# EAGLE design Placa_1 (EAGLE 8.3.2)
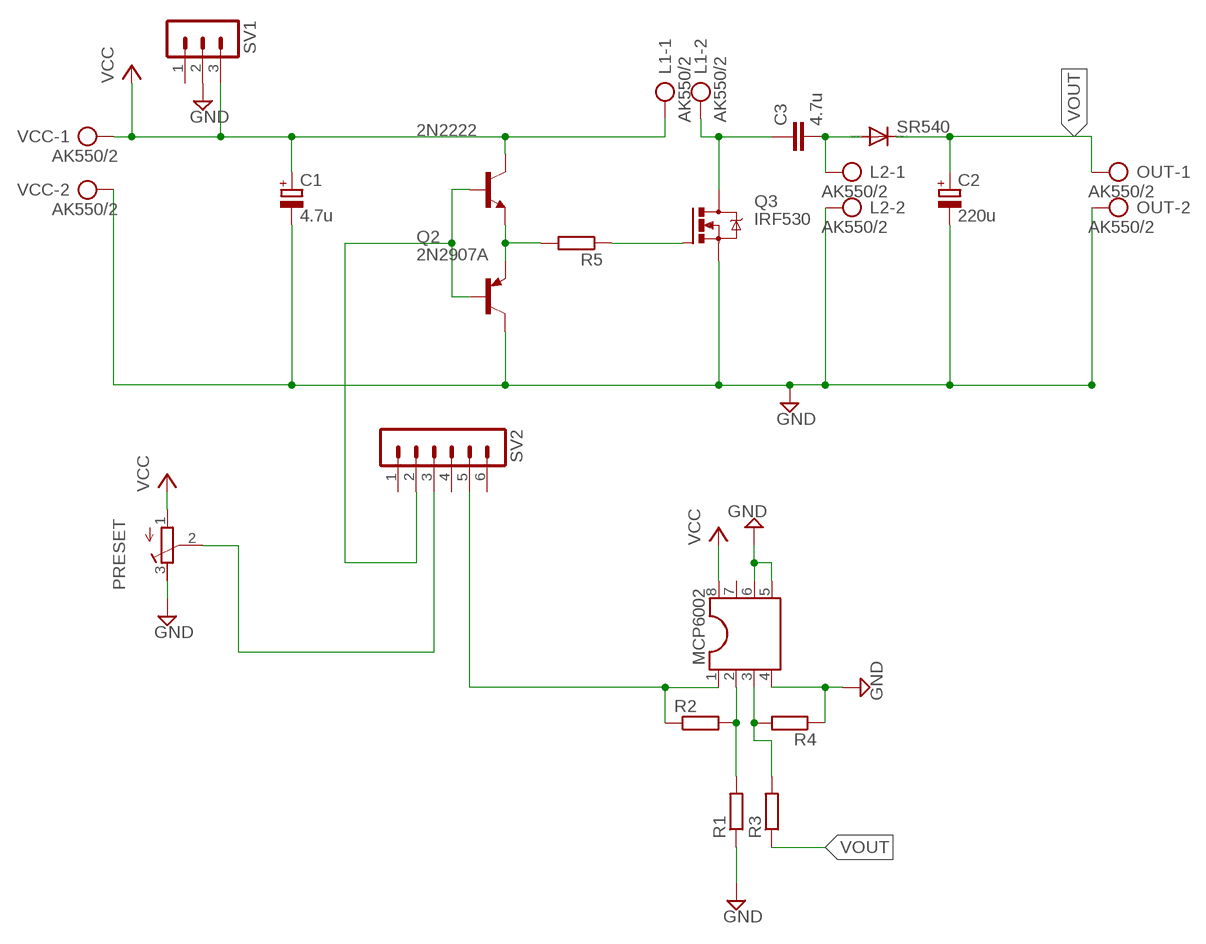
[diagram p0: schematic, sheet 1]

## Parts
2N2222  2N2222-NPN-TO92-EBC  [TO92-EBC]
C1  4.7u  CPOL-EUE5-8.5  [E5-8,5]
C2  220u  CPOL-EUE5-8.5  [E5-8,5]
C3  4.7u  C-EU075-052X106  [C075-052X106]
L1  AK550/2  [AK550/2]
L2  AK550/2  [AK550/2]
MCP6002  DIL8  [DIL08]
OUT  AK550/2  [AK550/2]
PRESET  R-TRIMM64W  [RTRIM64W]
Q2  2N2907A  [TO18]
Q3  IRF530  [TO220BV]
R1  R-EU_0207/10  [0207/10]
R2  R-EU_0207/10  [0207/10]
R3  R-EU_0207/10  [0207/10]
R4  R-EU_0207/10  [0207/10]
R5  R-EU_0207/10  [0207/10]
SR540  DIODE-DO27-15  [DO27-15]
SV1  MA03-1  [MA03-1]
SV2  MA06-1  [MA06-1]
VCC  AK550/2  [AK550/2]

## Nets
GND: C1.- C2.- L2.2 MCP6002.4 MCP6002.5 MCP6002.6 OUT.2 PRESET.3(E) Q2.3(C) Q3.S R1.1 R4.1 SV1.2 VCC.2
N$1: PRESET.2(S) SV2.3
N$2: C3.1 L1.2 Q3.D
N$3: C3.2 L2.1 SR540.A
N$4: 2N2222.E Q2.1(E) R5.2
N$5: MCP6002.3 R3.2 R4.2
N$6: 2N2222.B Q2.2(B) SV2.2
N$7: MCP6002.2 R1.2 R2.2
N$8: MCP6002.1 R2.1 SV2.5
N$9: Q3.G R5.1
VCC: 2N2222.C C1.+ L1.1 MCP6002.8 PRESET.1(A) SV1.3 VCC.1
VOUT: C2.+ OUT.1 R3.1 SR540.C
Unconnected: MCP6002.7 SV1.1 SV2.1 SV2.4 SV2.6

## Library data of the parts
2N2222 = transistor-neu-to92:*-NPN-: NPN Transistror
C1 C2 = resistor:CPOL-EU: POLARIZED CAPACITOR, European symbol
C3 = rcl:C-EU: CAPACITOR, European symbol
L1 L2 OUT VCC = con-ptr500:AK550/2: CONNECTOR; OC_FARNELL: unknown; OC_NEWARK: unknown
MCP6002 = ic-package:DIL8: Dual In Line / Socket
PRESET = resistor:R-TRIMM: Trimm resistor
Q2 = transistor-pnp:2N2907*: PNP Transistor
Q3 = transistor-power:IRF530: HEXFET Power MOSFET
R1-R5 = rcl:R-EU_: RESISTOR, European symbol
SR540 = diode:DIODE-: DIODE
SV1 = con-lstb:MA03-1: PIN HEADER; OC_FARNELL: unknown; OC_NEWARK: unknown
SV2 = con-lstb:MA06-1: PIN HEADER; OC_FARNELL: unknown; OC_NEWARK: unknown

## Board
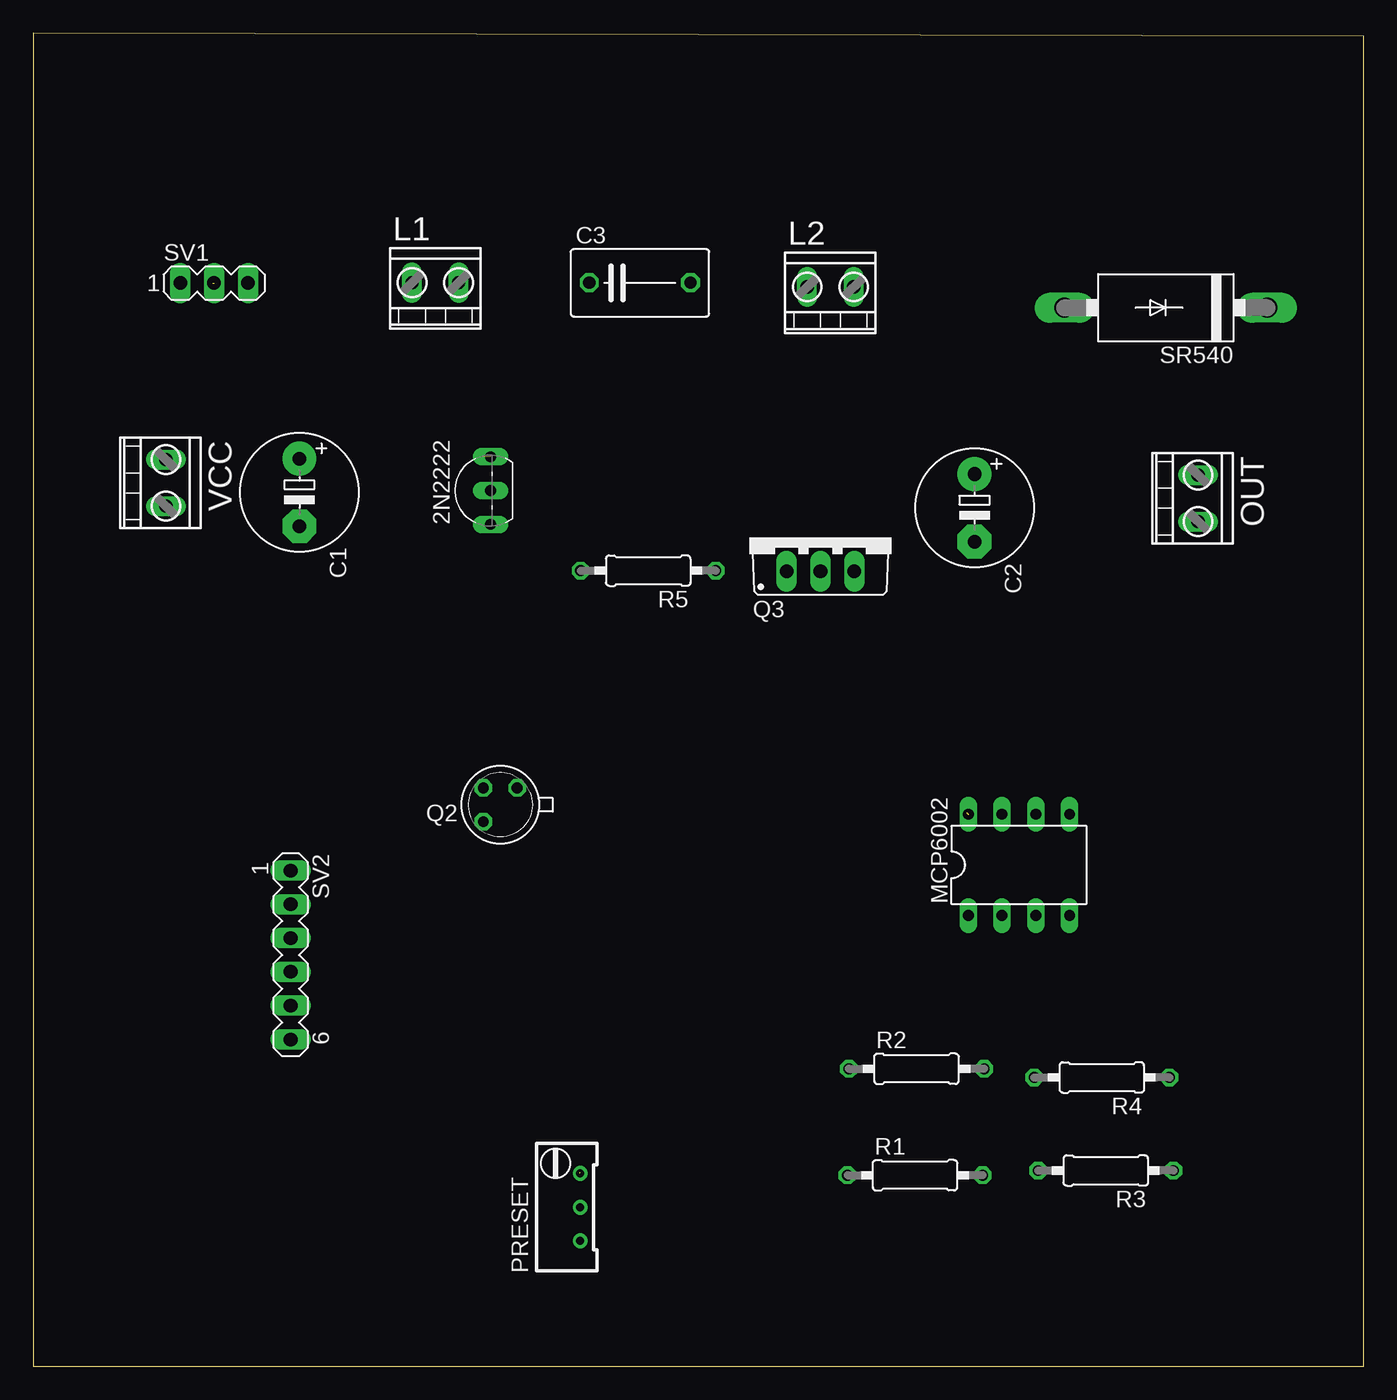
[diagram p1: board, top side]
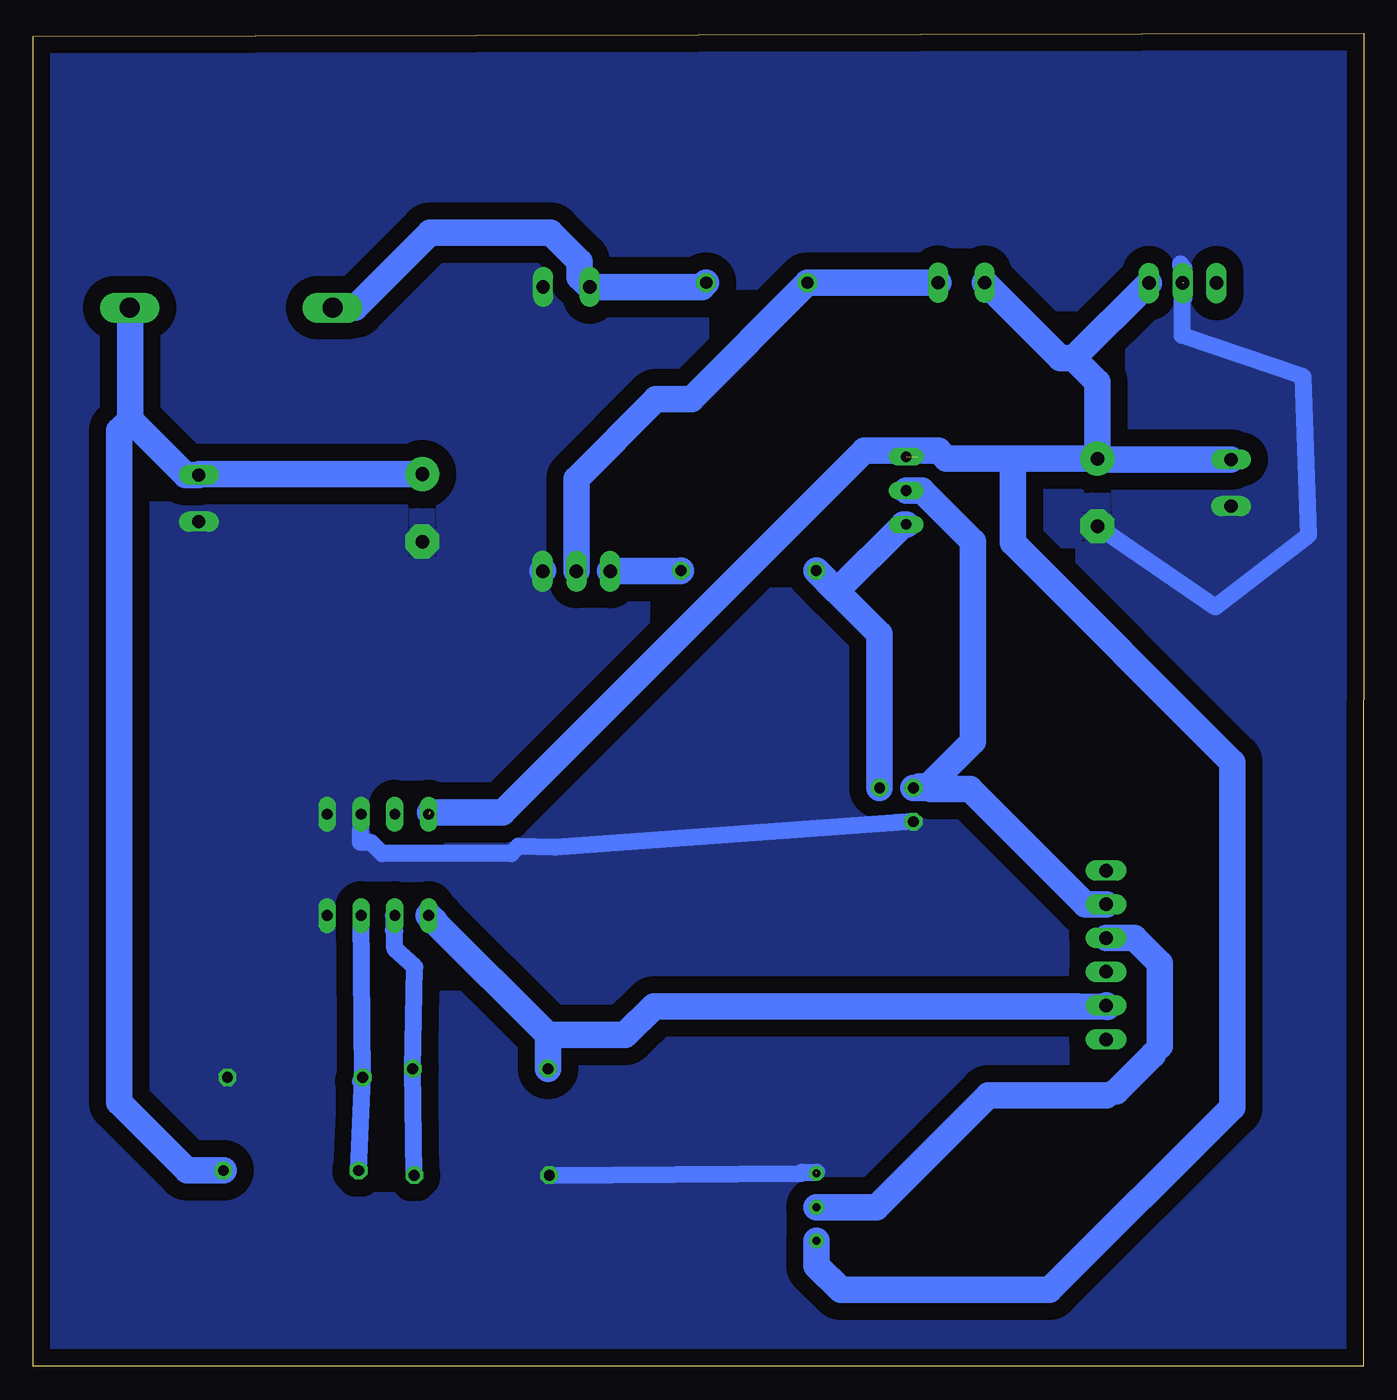
[diagram p2: board, bottom side, seen from below]

Size 100.01 x 100.21 mm. Coordinates in mm from the lower left corner, seen from the top.
Outline: 0.01,0 100.01,0 100.01,100 0,100.21 0.01,0
Copper layers (1*16): Top 0.035mm / dielectric 1.5mm / Bottom 0.035mm
Design rules "default *": minimum track width 1mm, minimum drill 0.35mm, track to track 1mm, track to pad 1mm, pad to pad 6mil, via to via 6mil, smd to smd 6mil, copper to edge 1mm, drill to drill 6mil, minimum pad ring 10mil, minimum via ring 8mil, stop-mask expansion 4mil, vias tented up to drill 0mil, thermal gap 10mil

### Footprints (pad centres in the part's own frame; a part is rotated, then mirrored left to right if it is on the bottom)
TO92-EBC = drill 0.813 long: B 0,-1.27; C 2.54,-1.27; E -2.54,-1.27
E5-8,5 = drill 1.016 pad 2.54: + -2.54,0 | drill 1.016 pad 2.54 octagon: - 2.54,0
C075-052X106 = drill 0.914 octagon: 1 -3.81,0; 2 3.81,0
AK550/2 = drill 1 pad 1.5 long: 1 -1.75,0; 2 1.75,0
DIL08 = drill 0.813 long: 1 -3.81,-3.81; 2 -1.27,-3.81; 3 1.27,-3.81; 4 3.81,-3.81; 5 3.81,3.81; 6 1.27,3.81; 7 -1.27,3.81; 8 -3.81,3.81
RTRIM64W = drill 0.61: 1 1.27,-2.54; 2 1.27,0; 3 1.27,2.54
TO18 = drill 0.813 octagon: 1 -1.27,-1.27; 2 1.27,-1.27; 3 1.27,1.27
TO220BV = drill 1.016 long: D 0,-2.54; G -2.54,-2.54; S 2.54,-2.54
0207/10 = drill 0.813 octagon: 1 -5.08,0; 2 5.08,0
DO27-15 = drill 1.499 long: A 7.62,0; C -7.62,0
MA03-1 = drill 1.016 long: 1 -2.54,0; 2 0,0; 3 2.54,0
MA06-1 = drill 1.016 long: 1 -6.35,0; 2 -3.81,0; 3 -1.27,0; 4 1.27,0; 5 3.81,0; 6 6.35,0

### Placement (x,y rotation side)
2N2222  33.11,65.83 90 top
C1  20.01,65.69 270 top
C2  70.76,64.53 270 top
C3  45.61,81.45 0 top
L1  30.23,81.46 0 top
L2  59.93,81.13 0 top
MCP6002  74.1,37.69 0 top
OUT  87.57,65.25 270 top
PRESET  39.85,11.96 0 top
Q2  35.11,42.21 180 top
Q3  59.18,62.31 0 top
R1  66.29,14.36 0 top
R2  66.4,22.36 0 top
R3  80.63,14.71 180 top
R4  80.33,21.71 180 top
R5  46.23,59.81 180 top
SR540  85.14,79.57 180 top
SV1  13.6,81.43 0 top
SV2  19.35,30.92 270 top
VCC  9.97,66.41 270 top

### Tracks (layer width: path | path; a pad name or v marks a point on that pad's centre or on a via)
GND  (2 unrouted)
  Bottom 1.27: C1.- 11.14,57.08 4.12,62.49 4.55,74.38 13.64,77.49 13.61,80.23 13.5,80.34 13.5,81.43 | 13.5,81.43 13.5,82.52 | 13.5,82.52 13.74,82.76 13.74,82.88 13.73,82.75 13.5,82.52 | 13.5,82.52 13.5,81.43 | Q2.3 60.78,39.01 63.55,39.08 64.09,38.54 73.78,38.54 74.61,39.37 75.41,39.39 MCP6002.6 | R1.1 42.31,14.49 42.21,14.6 41.12,14.6
  Bottom 2: 61.68,59.81 Q3.S
  pour Bottom (isolate 1.27): 0.68,0.22 0.68,98.12 1.13,98.57 98.38,98.57 98.52,98.71 98.52,1.08 98.95,0.65
N$1
  Bottom 1.27: 19.32,20.38 19.02,20.68 18.57,20.68 | 15.83,23.43 15.83,23.58 15.31,24.1
  Bottom 2: PRESET.2 36.64,11.96 28.22,20.38 19.32,20.38 | 18.57,20.68 15.83,23.43 | 15.31,24.1 15.31,30.28 17.22,32.19 SV2.3
N$2
  Bottom 2: L1.2 C3.1 50.54,72.71 53.18,72.71 59.18,66.71 Q3.D
N$3
  Bottom 2: SR540.A 75.82,79.57 70.18,85.21 61.11,85.21 58.92,83.03 58.92,81.88 L2.1 49.74,81.13 C3.2
N$4
  Bottom 2: Q2.1 36.38,55.04 39.61,58.27 | 39.61,58.27 R5.2 | 2N2222.E 34.6,63.29 39.61,58.27
N$5
  Bottom 1.016: 75.55,21.41 R4.2
  Bottom 1.27: R3.2 R4.2 MCP6002.3
N$6
  Bottom 2: SV2.2 20.9,34.73 29.58,43.41 32.55,43.41 32.74,43.6 | 32.74,43.6 33.38,43.6 | 2N2222.B 33.2,65.83 29.38,62.01 29.38,46.96 32.74,43.6 | Q2.2 32.86,43.48 32.74,43.6
N$7
  Bottom 1.27: R1.2 R2.2 71.33,30.01 72.83,31.38 72.83,32.69 72.93,32.79 72.93,33.88 MCP6002.2
N$8
  Bottom 2: R2.1 61.32,24.91 | 69.83,33.42 61.32,24.91 | 69.83,33.42 69.83,33.49 | MCP6002.1 69.83,33.42 | 61.32,24.91 55.51,24.91 53.36,27.06 21.53,27.06 19.27,27 SV2.5
N$9
  Bottom 2: Q3.G 51.35,59.77 R5.1
VCC  (2 unrouted)
  Bottom 1.016: 32.16,68.34 32.05,68.23 31.36,68.23 31.46,68.34 32.16,68.34 | 32.16,68.34 33.54,68.34
  Bottom 2: L1.1 22.79,75.77 21.8,75.77 | SV1.3 21.8,75.77 | 26.51,68.23 C1.+ | 26.51,68.23 31.36,68.23 31.96,68.83 37.53,68.83 64.71,41.65 70.14,41.65 70.17,41.62 | C1.+ 20.01,73.98 21.8,75.77 | VCC.1 19.94,68.16 C1.+ | 26.38,68.1 26.51,68.23 | PRESET.1 41.12,7.56 39.29,5.73 23.61,5.73 9.87,19.47 9.87,45.4 26.38,61.91 26.38,68.1 | 26.38,68.1 26.51,68.23
VOUT
  Bottom 2: 92.93,79.4 SR540.C 92.71,79.52 92.71,71.15 | C2.+ 87.5,67.07 OUT.1 88.56,67 92.71,71.15 | R3.1 88.42,14.71 93.53,19.82 93.53,70.33 92.71,71.15